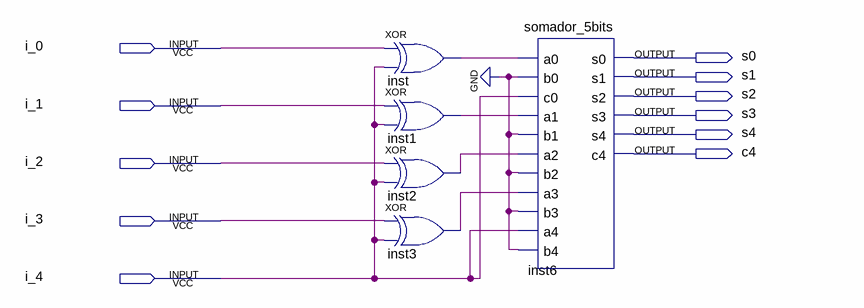
[diagram p0: schematic sheet]
// Quartus schematic sinal_complemento.bdf as structural Verilog: 5 symbols, 11 pins
module sinal_complemento (
  input  i_0,
  input  i_1,
  input  i_2,
  input  i_3,
  input  i_4,
  output s0,
  output s1,
  output s2,
  output s3,
  output s4,
  output c4
);

  wire inst1_out, inst2_out, inst3_out, inst_out;

  xor inst (inst_out, i_0, i_4);
  xor inst1 (inst1_out, i_1, i_4);
  xor inst2 (inst2_out, i_2, i_4);
  xor inst3 (inst3_out, i_3, i_4);
  somador_5bits inst6 (
    .a0(inst_out), .b0(1'b0), .c0(i_4), .a1(inst1_out), .b1(1'b0), .a2(inst2_out), .b2(1'b0), .a3(inst3_out),
    .b3(1'b0), .a4(i_4), .b4(1'b0), .s0(s0), .s1(s1), .s2(s2), .s3(s3), .s4(s4), .c4(c4));
endmodule
